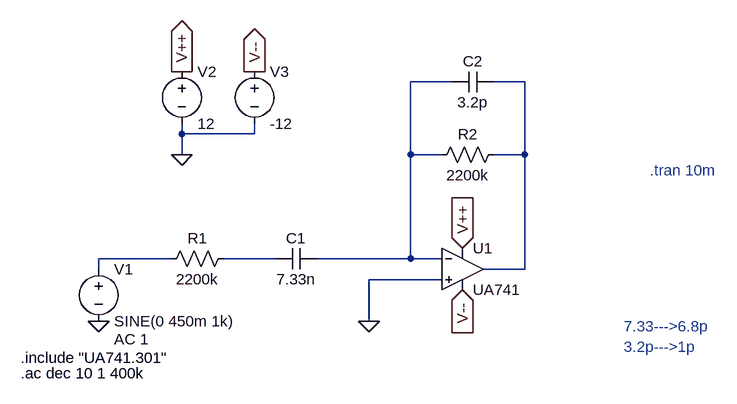
[diagram p0: schematic stage3.asc]
stage3.asc, the LTspice schematic file:
Version 4
SHEET 1 880 680
WIRE 144 192 80 192
WIRE 256 192 208 192
WIRE -272 272 -272 256
WIRE -160 272 -160 256
WIRE -160 272 -272 272
WIRE -272 304 -272 272
WIRE 80 304 80 192
WIRE 128 304 80 304
WIRE 256 304 256 192
WIRE 256 304 208 304
WIRE -288 464 -400 464
WIRE -128 464 -208 464
WIRE 80 464 80 304
WIRE 80 464 -64 464
WIRE 128 464 80 464
WIRE -400 480 -400 464
WIRE 256 480 256 304
WIRE 256 480 192 480
WIRE 128 496 16 496
WIRE 16 560 16 496
FLAG 16 560 0
FLAG -400 560 0
FLAG -272 304 0
FLAG -272 176 V++
IOPIN -272 176 Out
FLAG -160 176 V--
IOPIN -160 176 Out
FLAG 160 448 V++
IOPIN 160 448 In
FLAG 160 512 V--
IOPIN 160 512 In
DATAFLAG 256 448 ""
DATAFLAG 256 240 ""
DATAFLAG 256 240 ""
DATAFLAG 256 240 ""
DATAFLAG 256 240 ""
DATAFLAG 256 240 ""
SYMBOL res 224 288 R90
WINDOW 0 0 56 VBottom 2
WINDOW 3 32 56 VTop 2
SYMATTR InstName R2
SYMATTR Value 2200k
SYMBOL cap 208 176 R90
WINDOW 0 0 32 VBottom 2
WINDOW 3 32 32 VTop 2
SYMATTR InstName C2
SYMATTR Value 3.2p
SYMBOL cap -64 448 R90
WINDOW 0 0 32 VBottom 2
WINDOW 3 32 32 VTop 2
SYMATTR InstName C1
SYMATTR Value 7.33n
SYMBOL res -192 448 R90
WINDOW 0 0 56 VBottom 2
WINDOW 3 32 56 VTop 2
SYMATTR InstName R1
SYMATTR Value 2200k
SYMBOL voltage -400 464 R0
WINDOW 123 24 124 Left 2
WINDOW 39 0 0 Left 0
SYMATTR Value2 AC 1
SYMATTR InstName V1
SYMATTR Value SINE(0 450m 1k)
SYMBOL OpAmps\\opamp2 160 416 R0
SYMATTR InstName U1
SYMATTR Value UA741
SYMBOL voltage -272 160 R0
WINDOW 123 0 0 Left 0
WINDOW 39 0 0 Left 0
SYMATTR InstName V2
SYMATTR Value 12
SYMBOL voltage -160 160 R0
WINDOW 123 0 0 Left 0
WINDOW 39 0 0 Left 0
SYMATTR InstName V3
SYMATTR Value -12
TEXT -520 616 Left 2 !.include "UA741.301"
TEXT -520 640 Left 2 !.ac dec 10 1 400k
TEXT 448 328 Left 2 ;.tran 10m
TEXT 408 568 Left 2 ;7.33--->6.8p\n3.2p--->1p

The netlist it stands for:
* stage3.asc
R2 N002 N001 2200k
C2 N002 N001 3.2p
C1 N001 N004 7.33n
R1 N004 N003 2200k
V1 N003 0 SINE(0 450m 1k) AC 1
XU1 0 N001 V++ V-- N002 UA741  ; pins In+ In- V+ V- OUT
V2 V++ 0 12
V3 V-- 0 -12
.include "UA741.301"
.ac dec 10 1 400k
* .tran 10m
* 7.33--->6.8p
* 3.2p--->1p
.backanno
.end